# EasyEDA Pro project 0.8_0.5_fpc_45degree.epro

# Board 0.8_0.5_fpc_45degree
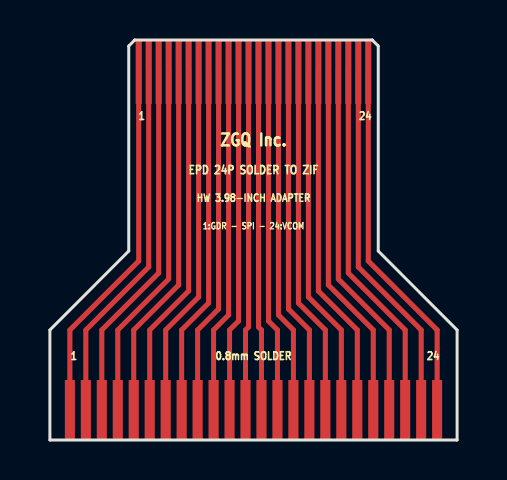
[diagram p0: board, top side]
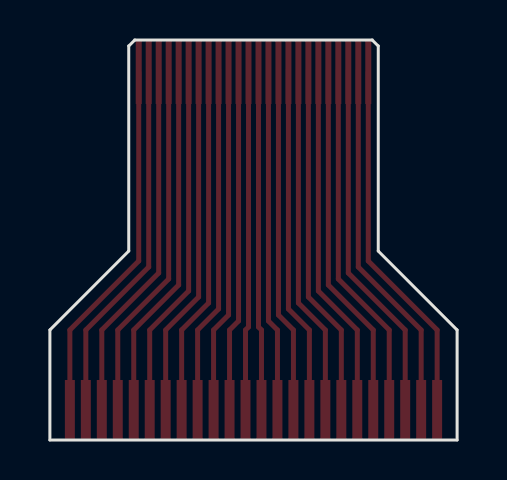
[diagram p1: board, bottom side, seen from below]

Outline 20.4 x 20 mm; copper layers: Top Layer, Bottom Layer. Coordinates in mm from the lower left corner of the outline.
Outline path: 0,5.5 3.95,9.45 3.95,19.7 4.25,20 16.15,20 16.45,19.7 16.45,9.45 20.4,5.5 20.4,0 0,0 0,5.5
Stack: Top Layer 0.035mm / Bottom Layer 0.035mm

## Design rules (mm)
spacing copperThickness1oz (default): track to track 0.102, other pairs 0.152 to 0.3
track width copperThickness1oz (default): min 0.127, default 0.254, max 2.54
differential pair differentialPair (default): width min 0.127, default 2.54, max 2.54; gap min 0.127, default 0.152

## Placement (name value [footprint] x y rotation side)
J_Screen  -  [0.8mm_24P]  10.2 1.5 0 top
J_ZIF  -  [0.5mm_24P_ZIF]  10.2 18.4 0 top

## Footprints (pads in the part's own frame, mm; a bottom-side part is the same pattern mirrored in y, then rotated)
0.5mm_24P_ZIF
  rect 0.3x3.2 smd: 1(-5.75,0) 2(-5.25,0) 3(-4.75,0) 4(-4.25,0) 5(-3.75,0) 6(-3.25,0) 7(-2.75,0) 8(-2.25,0) 9(-1.75,0) 10(-1.25,0) 11(-0.75,0) 12(-0.25,0) 13(0.25,0) 14(0.75,0) 15(1.25,0) 16(1.75,0) 17(2.25,0) 18(2.75,0) 19(3.25,0) 20(3.75,0) 21(4.25,0) 22(4.75,0) 23(5.25,0) 24(5.75,0)
0.8mm_24P
  rect 0.5x3 smd: 1(-9.2,0) 2(-8.4,0) 3(-7.6,0) 4(-6.8,0) 5(-6,0) 6(-5.2,0) 7(-4.4,0) 8(-3.6,0) 9(-2.8,0) 10(-2,0) 11(-1.2,0) 12(-0.4,0) 13(0.4,0) 14(1.2,0) 15(2,0) 16(2.8,0) 17(3.6,0) 18(4.4,0) 19(5.2,0) 20(6,0) 21(6.8,0) 22(7.6,0) 23(8.4,0) 24(9.2,0)

## Nets
Pin_1: J_Screen.1 J_ZIF.1
Pin_2: J_Screen.2 J_ZIF.2
Pin_3: J_Screen.3 J_ZIF.3
Pin_4: J_Screen.4 J_ZIF.4
Pin_5: J_Screen.5 J_ZIF.5
Pin_6: J_Screen.6 J_ZIF.6
Pin_7: J_Screen.7 J_ZIF.7
Pin_8: J_Screen.8 J_ZIF.8
Pin_9: J_Screen.9 J_ZIF.9
Pin_10: J_Screen.10 J_ZIF.10
Pin_11: J_Screen.11 J_ZIF.11
Pin_12: J_Screen.12 J_ZIF.12
Pin_13: J_Screen.13 J_ZIF.13
Pin_14: J_Screen.14 J_ZIF.14
Pin_15: J_Screen.15 J_ZIF.15
Pin_16: J_Screen.16 J_ZIF.16
Pin_17: J_Screen.17 J_ZIF.17
Pin_18: J_Screen.18 J_ZIF.18
Pin_19: J_Screen.19 J_ZIF.19
Pin_20: J_Screen.20 J_ZIF.20
Pin_21: J_Screen.21 J_ZIF.21
Pin_22: J_Screen.22 J_ZIF.22
Pin_23: J_Screen.23 J_ZIF.23
Pin_24: J_Screen.24 J_ZIF.24

## Routing (per net, layer and track width the routed paths; a pad name or vN(x,y) marks a point on that pad's centre or on a via; arc(x,y) is an arc through that point)
Pin_1: length 16.8
  Top Layer w0.25: 1,3 1,5.5 4.45,8.95 J_ZIF.1
Pin_2: length 16.8
  Top Layer w0.25: 4.95,18.5 4.95,8.65 1.8,5.5 1.8,3
Pin_3: length 16.7
  Top Layer w0.25: 5.45,18.5 5.45,8.35 2.6,5.5 2.6,3
Pin_4: length 16.6
  Top Layer w0.25: 3.4,3 3.4,5.5 5.95,8.05 5.95,18.5
Pin_5: length 16.4
  Top Layer w0.25: 4.2,3 4.2,5.5 6.45,7.75 6.45,18.5
Pin_6: length 16.3
  Top Layer w0.25: 6.95,18.5 6.95,7.45 5,5.5 5,3
Pin_7: length 16.2
  Top Layer w0.25: 5.8,3 5.8,5.5 7.45,7.15 7.45,18.5
Pin_8: length 16.1
  Top Layer w0.25: 6.6,3 6.6,5.5 7.95,6.85 7.95,18.5
Pin_9: length 15.9
  Top Layer w0.25: 7.4,3 7.4,5.5 8.45,6.55 8.45,18.5
Pin_10: length 15.8
  Top Layer w0.25: 8.2,3 8.2,5.5 8.95,6.25 8.95,18.5
Pin_11: length 15.7
  Top Layer w0.25: 9.45,18.5 9.45,5.95 9,5.5 9,3
Pin_12: length 15.6
  Top Layer w0.25: 9.95,18.5 9.95,5.65 9.8,5.5 9.8,3
Pin_13: length 15.6
  Top Layer w0.25: 10.6,3 10.6,5.5 10.45,5.65 10.45,18.5
Pin_14: length 15.7
  Top Layer w0.25: 11.4,3 11.4,5.5 10.95,5.95 10.95,18.5
Pin_15: length 15.8
  Top Layer w0.25: 11.45,18.5 11.45,6.25 12.2,5.5 12.2,3
Pin_16: length 15.9
  Top Layer w0.25: 13,3 13,5.5 11.95,6.55 11.95,18.5
Pin_17: length 16.1
  Top Layer w0.25: 13.8,3 13.8,5.5 12.45,6.85 12.45,18.5
Pin_18: length 16.2
  Top Layer w0.25: 12.95,18.5 12.95,7.15 14.6,5.5 14.6,3
Pin_19: length 16.3
  Top Layer w0.25: 15.4,3 15.4,5.5 13.45,7.45 13.45,18.5
Pin_20: length 16.4
  Top Layer w0.25: 16.2,3 16.2,5.5 13.95,7.75 13.95,18.5
Pin_21: length 16.6
  Top Layer w0.25: 14.45,18.5 14.45,8.05 17,5.5 17,3
Pin_22: length 16.7
  Top Layer w0.25: 14.95,18.5 14.95,8.35 17.8,5.5 17.8,3
Pin_23: length 16.8
  Top Layer w0.25: 15.45,18.5 15.45,8.65 18.6,5.5 18.6,3
Pin_24: length 16.8
  Top Layer w0.25: 19.4,3 19.4,5.5 15.95,8.95 J_ZIF.24

## Text on the board
Top Silkscreen Layer: 1:GDR - SPI - 24:VCOM | HW 3.98-INCH ADAPTER | 1 | 0.8mm SOLDER | 24 | EPD 24P SOLDER TO ZIF | ZGQ Inc.
Ratline Layer: PI STIFFENER | TOTAL 0.3mm | SOLDER PI STIFFENER 0.15mm
